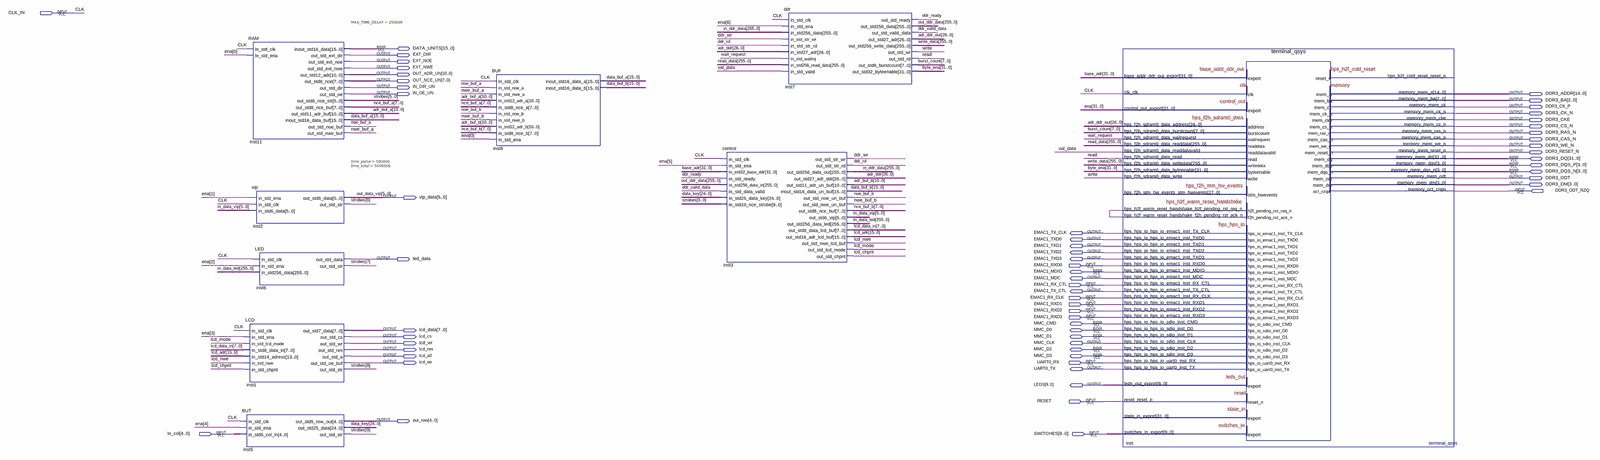
[diagram p0: schematic sheet, whole]
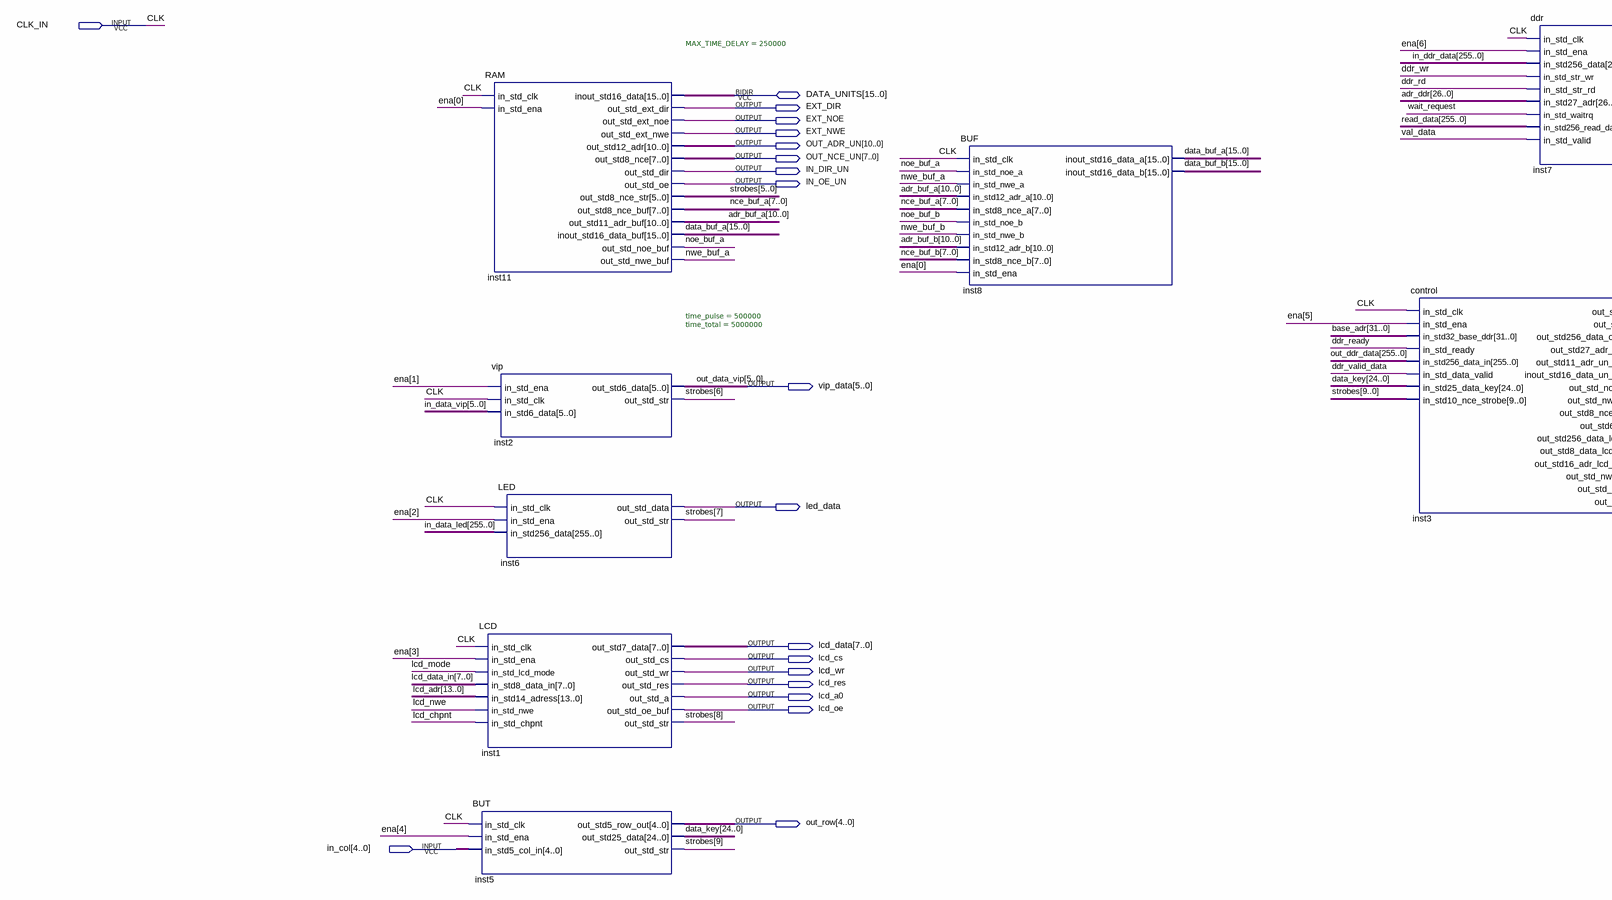
[diagram p1: schematic sheet, left part]
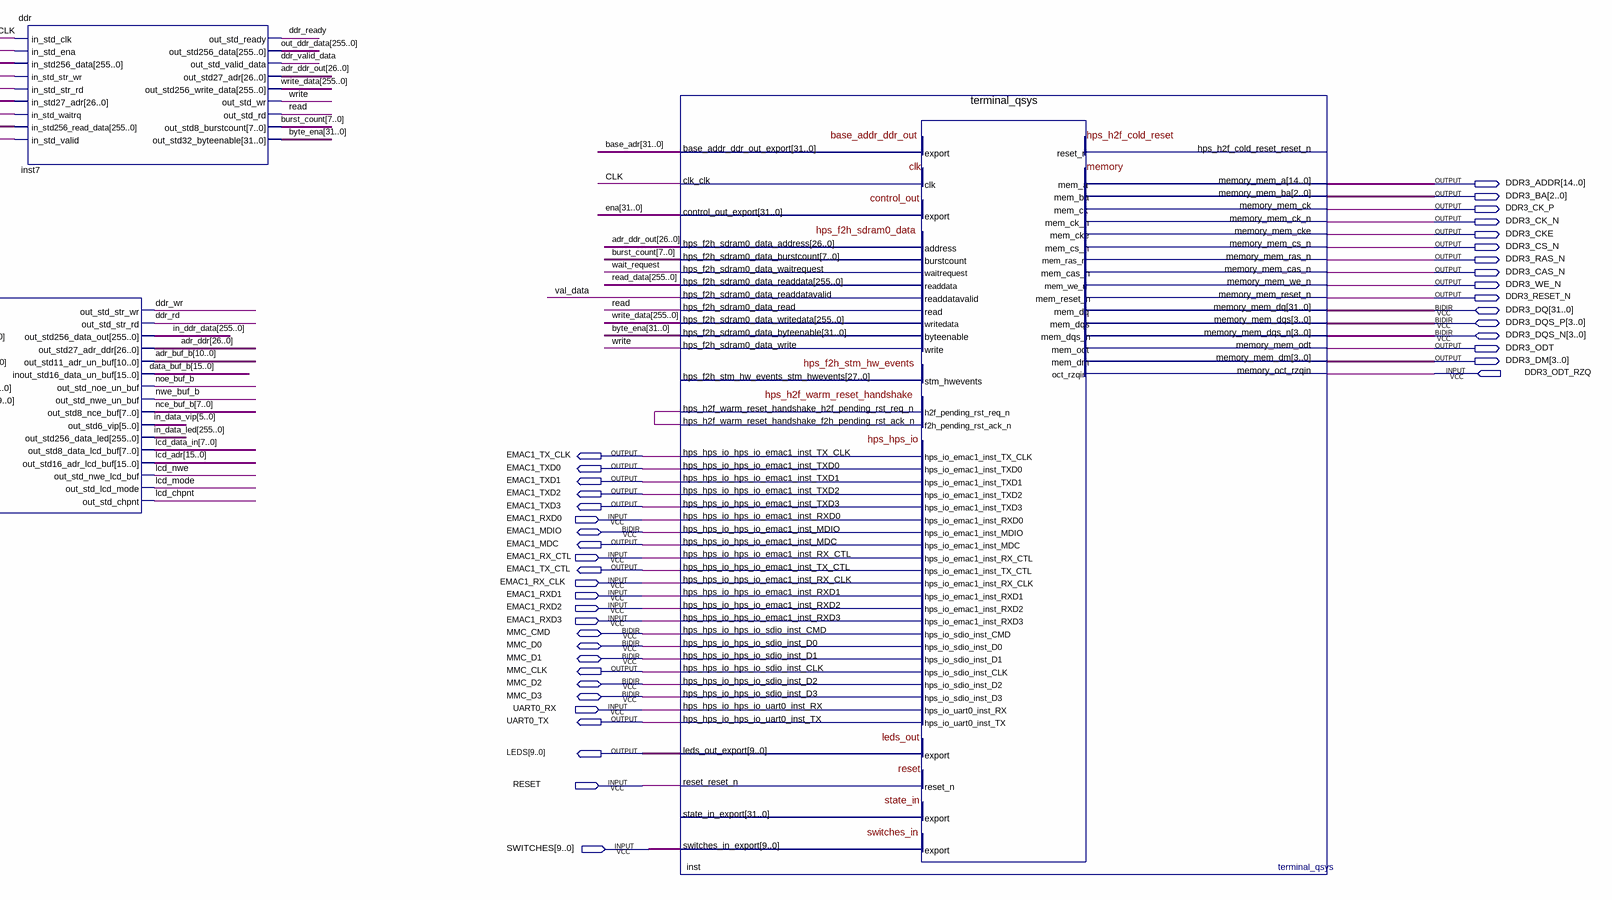
[diagram p2: schematic sheet, right part]
// Quartus schematic terminal.bdf as structural Verilog: 9 symbols, 60 pins
module terminal (
  input  CLK_IN,
  input  DDR3_ODT_RZQ,
  input  EMAC1_RXD0,
  input  EMAC1_RX_CTL,
  input  EMAC1_RX_CLK,
  input  EMAC1_RXD1,
  input  EMAC1_RXD2,
  input  EMAC1_RXD3,
  input  UART0_RX,
  input  RESET,
  input  [4:0] in_col,
  input  [9:0] SWITCHES,
  inout  [15:0] DATA_UNITS,
  inout  [31:0] DDR3_DQ,
  inout  [3:0] DDR3_DQS_P,
  inout  [3:0] DDR3_DQS_N,
  inout  EMAC1_MDIO,
  inout  MMC_CMD,
  inout  MMC_D0,
  inout  MMC_D1,
  inout  MMC_D2,
  inout  MMC_D3,
  output EXT_DIR,
  output EXT_NOE,
  output EXT_NWE,
  output [10:0] OUT_ADR_UN,
  output [7:0] OUT_NCE_UN,
  output IN_DIR_UN,
  output IN_OE_UN,
  output [14:0] DDR3_ADDR,
  output [2:0] DDR3_BA,
  output DDR3_CK_P,
  output DDR3_CK_N,
  output DDR3_CKE,
  output DDR3_CS_N,
  output DDR3_RAS_N,
  output DDR3_CAS_N,
  output DDR3_WE_N,
  output DDR3_RESET_N,
  output DDR3_ODT,
  output [3:0] DDR3_DM,
  output [5:0] vip_data,
  output EMAC1_TX_CLK,
  output EMAC1_TXD0,
  output EMAC1_TXD1,
  output EMAC1_TXD2,
  output led_data,
  output EMAC1_TXD3,
  output EMAC1_MDC,
  output EMAC1_TX_CTL,
  output [7:0] lcd_data,
  output lcd_cs,
  output lcd_wr,
  output MMC_CLK,
  output lcd_res,
  output lcd_a0,
  output lcd_oe,
  output UART0_TX,
  output [9:0] LEDS,
  output [4:0] out_row
);

  wire ddr_rd, ddr_ready, ddr_valid_data, ddr_wr, inst_hps_h2f_warm_reset_handshake_h2f_pending_rst_req_n,
       lcd_chpnt, lcd_mode, lcd_nwe, noe_buf_a, noe_buf_b, nwe_buf_a, nwe_buf_b, read, val_data,
       wait_request, write;
  wire [5:0] in_data_vip;
  wire [7:0] burst_count, lcd_data_in, nce_buf_a, nce_buf_b;
  wire [9:0] strobes;
  wire [10:0] adr_buf_a, adr_buf_b;
  wire [15:0] data_buf_a, data_buf_b, lcd_adr;
  wire [24:0] data_key;
  wire [26:0] adr_ddr, adr_ddr_out;
  wire [31:0] base_adr, byte_ena, ena;
  wire [255:0] in_data_led, in_ddr_data, out_ddr_data, read_data, write_data;

  BUT inst5 (
    .in_std_clk(CLK_IN), .in_std_ena(ena[4]), .in_std5_col_in(in_col), .out_std5_row_out(out_row),
    .out_std25_data(data_key), .out_std_str(strobes[9]));
  RAM #(.MAX_TIME_DELAY(250000)) inst11 (
    .in_std_clk(CLK_IN), .in_std_ena(ena[0]), .out_std_ext_dir(EXT_DIR), .out_std_ext_noe(EXT_NOE),
    .out_std_ext_nwe(EXT_NWE), .out_std12_adr(OUT_ADR_UN), .out_std8_nce(OUT_NCE_UN),
    .out_std_dir(IN_DIR_UN), .out_std_oe(IN_OE_UN), .out_std8_nce_str(strobes[5:0]),
    .out_std8_nce_buf(nce_buf_a), .out_std11_adr_buf(adr_buf_a), .out_std_noe_buf(noe_buf_a),
    .out_std_nwe_buf(nwe_buf_a), .inout_std16_data(DATA_UNITS), .inout_std16_data_buf(data_buf_a));
  vip #(.time_pulse(500000), .time_total(5000000)) inst2 (
    .in_std_ena(ena[1]), .in_std_clk(CLK_IN), .in_std6_data(in_data_vip), .out_std6_data(vip_data),
    .out_std_str(strobes[6]));
  LED inst6 (
    .in_std_clk(CLK_IN), .in_std_ena(ena[2]), .in_std256_data(in_data_led), .out_std_data(led_data),
    .out_std_str(strobes[7]));
  LCD inst1 (
    .in_std_clk(CLK_IN), .in_std_ena(ena[3]), .in_std_lcd_mode(lcd_mode), .in_std8_data_in(lcd_data_in),
    .in_std14_adress(lcd_adr[13:0]), .in_std_nwe(lcd_nwe), .in_std_chpnt(lcd_chpnt),
    .out_std7_data(lcd_data), .out_std_cs(lcd_cs), .out_std_wr(lcd_wr), .out_std_res(lcd_res),
    .out_std_a(lcd_a0), .out_std_oe_buf(lcd_oe), .out_std_str(strobes[8]));
  BUF inst8 (
    .in_std_clk(CLK_IN), .in_std_noe_a(noe_buf_a), .in_std_nwe_a(nwe_buf_a), .in_std12_adr_a(adr_buf_a),
    .in_std8_nce_a(nce_buf_a), .in_std_noe_b(noe_buf_b), .in_std_nwe_b(nwe_buf_b),
    .in_std12_adr_b(adr_buf_b), .in_std8_nce_b(nce_buf_b), .in_std_ena(ena[0]),
    .inout_std16_data_a(data_buf_a), .inout_std16_data_b(data_buf_b));
  control inst3 (
    .in_std_clk(CLK_IN), .in_std_ena(ena[5]), .in_std32_base_ddr(base_adr), .in_std_ready(ddr_ready),
    .in_std256_data_in(out_ddr_data), .in_std_data_valid(ddr_valid_data), .in_std25_data_key(data_key),
    .in_std10_nce_strobe(strobes), .out_std_str_wr(ddr_wr), .out_std_str_rd(ddr_rd),
    .out_std256_data_out(in_ddr_data), .out_std27_adr_ddr(adr_ddr), .out_std11_adr_un_buf(adr_buf_b),
    .out_std_noe_un_buf(noe_buf_b), .out_std_nwe_un_buf(nwe_buf_b), .out_std8_nce_buf(nce_buf_b),
    .out_std6_vip(in_data_vip), .out_std256_data_led(in_data_led), .out_std8_data_lcd_buf(lcd_data_in),
    .out_std16_adr_lcd_buf(lcd_adr), .out_std_nwe_lcd_buf(lcd_nwe), .out_std_lcd_mode(lcd_mode),
    .out_std_chpnt(lcd_chpnt), .inout_std16_data_un_buf(data_buf_b));
  ddr inst7 (
    .in_std_clk(CLK_IN), .in_std_ena(ena[6]), .in_std256_data(in_ddr_data), .in_std_str_wr(ddr_wr),
    .in_std_str_rd(ddr_rd), .in_std27_adr(adr_ddr), .in_std_waitrq(wait_request),
    .in_std256_read_data(read_data), .in_std_valid(val_data), .out_std_ready(ddr_ready),
    .out_std256_data(out_ddr_data), .out_std_valid_data(ddr_valid_data), .out_std27_adr(adr_ddr_out),
    .out_std256_write_data(write_data), .out_std_wr(write), .out_std_rd(read),
    .out_std8_burstcount(burst_count), .out_std32_byteenable(byte_ena));
  terminal_qsys inst (
    .clk_clk(CLK_IN), .hps_f2h_sdram0_data_address(adr_ddr_out),
    .hps_f2h_sdram0_data_burstcount(burst_count), .hps_f2h_sdram0_data_read(read),
    .hps_f2h_sdram0_data_writedata(write_data), .hps_f2h_sdram0_data_byteenable(byte_ena),
    .hps_f2h_sdram0_data_write(write),
    .hps_h2f_warm_reset_handshake_f2h_pending_rst_ack_n(inst_hps_h2f_warm_reset_handshake_h2f_pending_rst_req_n),
    .hps_hps_io_hps_io_emac1_inst_RXD0(EMAC1_RXD0), .hps_hps_io_hps_io_emac1_inst_RX_CTL(EMAC1_RX_CTL),
    .hps_hps_io_hps_io_emac1_inst_RX_CLK(EMAC1_RX_CLK), .hps_hps_io_hps_io_emac1_inst_RXD1(EMAC1_RXD1),
    .hps_hps_io_hps_io_emac1_inst_RXD2(EMAC1_RXD2), .hps_hps_io_hps_io_emac1_inst_RXD3(EMAC1_RXD3),
    .hps_hps_io_hps_io_uart0_inst_RX(UART0_RX), .memory_oct_rzqin(DDR3_ODT_RZQ), .reset_reset_n(RESET),
    .switches_in_export(SWITCHES), .base_addr_ddr_out_export(base_adr), .control_out_export(ena),
    .hps_f2h_sdram0_data_waitrequest(wait_request), .hps_f2h_sdram0_data_readdata(read_data),
    .hps_f2h_sdram0_data_readdatavalid(val_data),
    .hps_h2f_warm_reset_handshake_h2f_pending_rst_req_n(inst_hps_h2f_warm_reset_handshake_h2f_pending_rst_req_n),
    .hps_hps_io_hps_io_emac1_inst_TX_CLK(EMAC1_TX_CLK), .hps_hps_io_hps_io_emac1_inst_TXD0(EMAC1_TXD0),
    .hps_hps_io_hps_io_emac1_inst_TXD1(EMAC1_TXD1), .hps_hps_io_hps_io_emac1_inst_TXD2(EMAC1_TXD2),
    .hps_hps_io_hps_io_emac1_inst_TXD3(EMAC1_TXD3), .hps_hps_io_hps_io_emac1_inst_MDC(EMAC1_MDC),
    .hps_hps_io_hps_io_emac1_inst_TX_CTL(EMAC1_TX_CTL), .hps_hps_io_hps_io_sdio_inst_CLK(MMC_CLK),
    .hps_hps_io_hps_io_uart0_inst_TX(UART0_TX), .leds_out_export(LEDS), .memory_mem_a(DDR3_ADDR),
    .memory_mem_ba(DDR3_BA), .memory_mem_ck(DDR3_CK_P), .memory_mem_ck_n(DDR3_CK_N),
    .memory_mem_cke(DDR3_CKE), .memory_mem_cs_n(DDR3_CS_N), .memory_mem_ras_n(DDR3_RAS_N),
    .memory_mem_cas_n(DDR3_CAS_N), .memory_mem_we_n(DDR3_WE_N), .memory_mem_reset_n(DDR3_RESET_N),
    .memory_mem_odt(DDR3_ODT), .memory_mem_dm(DDR3_DM), .hps_hps_io_hps_io_emac1_inst_MDIO(EMAC1_MDIO),
    .hps_hps_io_hps_io_sdio_inst_CMD(MMC_CMD), .hps_hps_io_hps_io_sdio_inst_D0(MMC_D0),
    .hps_hps_io_hps_io_sdio_inst_D1(MMC_D1), .hps_hps_io_hps_io_sdio_inst_D2(MMC_D2),
    .hps_hps_io_hps_io_sdio_inst_D3(MMC_D3), .memory_mem_dq(DDR3_DQ), .memory_mem_dqs(DDR3_DQS_P),
    .memory_mem_dqs_n(DDR3_DQS_N));  // open: hps_f2h_stm_hw_events_stm_hwevents, state_in_export, hps_h2f_cold_reset_reset_n

  // Other names for the same wires on the sheet: CLK = CLK_IN; out_data_vip[5:0] = vip_data
endmodule
